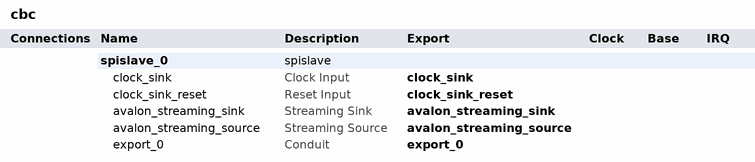
[diagram p0: system contents]
# Platform Designer (Qsys) system cbc, Cyclone IV E EP4CE115F29C7
# Parameters at their usual value, and those the tool derives, are not listed.
package require qsys
create_system cbc
set_project_property DEVICE_FAMILY {Cyclone IV E}
set_project_property DEVICE EP4CE115F29C7

add_instance spislave_0 spislave 14.0
set_instance_property spislave_0 AUTO_EXPORT true
set_instance_parameter_value spislave_0 SYNC_DEPTH 3

# exported interfaces
add_interface clock_sink clock sink
set_interface_property clock_sink EXPORT_OF spislave_0.clock_sink
add_interface clock_sink_reset reset sink
set_interface_property clock_sink_reset EXPORT_OF spislave_0.clock_sink_reset
add_interface export_0 conduit end
set_interface_property export_0 EXPORT_OF spislave_0.export_0
add_interface avalon_streaming_source avalon_streaming source
set_interface_property avalon_streaming_source EXPORT_OF spislave_0.avalon_streaming_source
add_interface avalon_streaming_sink avalon_streaming sink
set_interface_property avalon_streaming_sink EXPORT_OF spislave_0.avalon_streaming_sink

set_interconnect_requirement {$system} qsys_mm.clockCrossingAdapter HANDSHAKE
set_interconnect_requirement {$system} qsys_mm.maxAdditionalLatency 1
set_interconnect_requirement {$system} qsys_mm.insertDefaultSlave FALSE

save_system cbc.qsys
